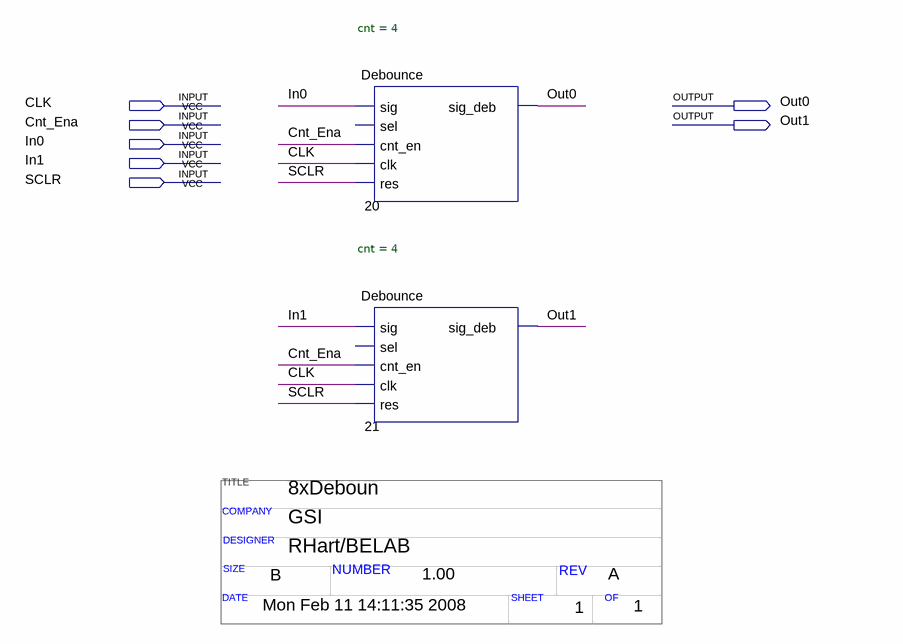
[diagram p0: schematic sheet]
// Quartus schematic 2xdeboun.bdf as structural Verilog: 2 symbols, 7 pins
// Title block: TITLE: 8xDeboun; COMPANY: GSI; DESIGNER: RHart/BELAB; SIZE: B; NUMBER: 1.00; REV: A; DATE: Mon Feb 11 14:11:35 2008; SHEET: 1; OF: 1
module \2xdeboun  (
  input  CLK,
  input  Cnt_Ena,
  input  In0,
  input  In1,
  input  SCLR,
  output Out0,
  output Out1
);

  Debounce #(.cnt(4)) u_20 (.sig(In0), .cnt_en(Cnt_Ena), .clk(CLK), .res(SCLR), .sig_deb(Out0));  // open: sel
  Debounce #(.cnt(4)) u_21 (.sig(In1), .cnt_en(Cnt_Ena), .clk(CLK), .res(SCLR), .sig_deb(Out1));  // open: sel
endmodule
